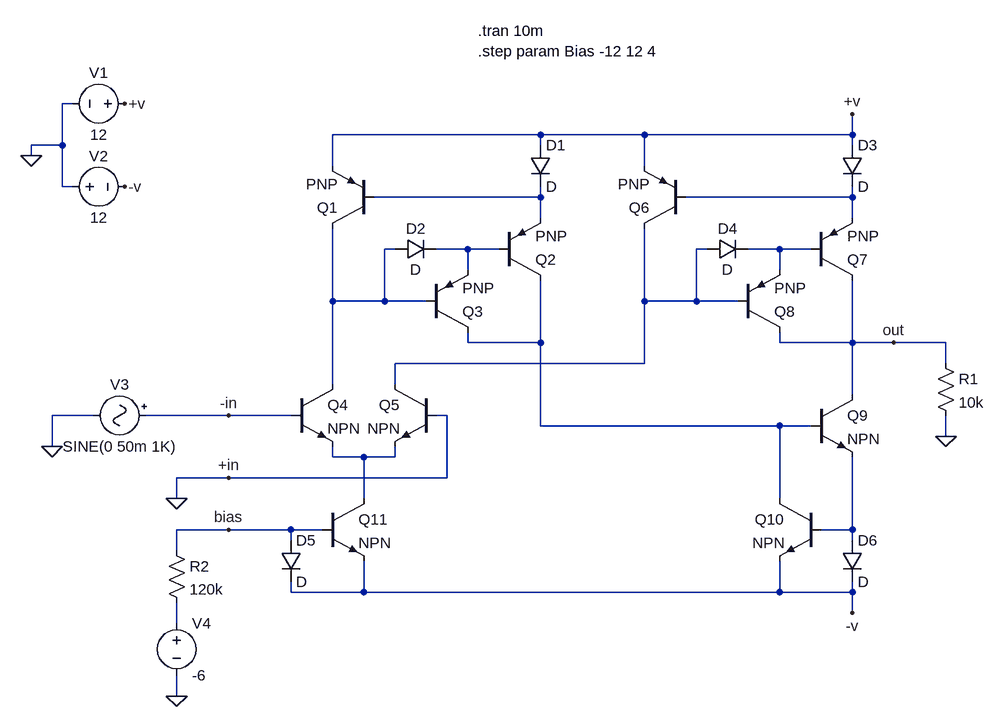
[diagram p0: schematic op-amp.asc]
op-amp.asc, the LTspice schematic file:
Version 4
SHEET 1 1428 976
WIRE -208 48 -224 48
WIRE 512 96 192 96
WIRE 672 96 512 96
WIRE 992 96 992 64
WIRE 992 96 672 96
WIRE -224 112 -224 48
WIRE -224 112 -272 112
WIRE 512 112 512 96
WIRE 992 112 992 96
WIRE -272 128 -272 112
WIRE 192 144 192 96
WIRE 672 144 672 96
WIRE -224 176 -224 112
WIRE -208 176 -224 176
WIRE 512 192 512 176
WIRE 512 192 256 192
WIRE 992 192 992 176
WIRE 992 192 736 192
WIRE 512 224 512 192
WIRE 992 224 992 192
WIRE 288 272 272 272
WIRE 400 272 352 272
WIRE 448 272 400 272
WIRE 768 272 752 272
WIRE 880 272 832 272
WIRE 928 272 880 272
WIRE 400 304 400 272
WIRE 880 304 880 272
WIRE 192 352 192 240
WIRE 272 352 272 272
WIRE 272 352 192 352
WIRE 336 352 272 352
WIRE 672 352 672 240
WIRE 752 352 752 272
WIRE 752 352 672 352
WIRE 816 352 752 352
WIRE 400 416 400 400
WIRE 512 416 512 320
WIRE 512 416 400 416
WIRE 880 416 880 400
WIRE 992 416 992 320
WIRE 992 416 880 416
WIRE 1056 416 992 416
WIRE 1136 416 1056 416
WIRE 672 448 672 352
WIRE 672 448 288 448
WIRE 1136 448 1136 416
WIRE 192 480 192 352
WIRE 288 480 288 448
WIRE 992 496 992 416
WIRE -176 528 -240 528
WIRE 32 528 -96 528
WIRE 128 528 32 528
WIRE 368 528 352 528
WIRE 512 544 512 416
WIRE 880 544 512 544
WIRE 928 544 880 544
WIRE 1136 560 1136 528
WIRE -240 576 -240 528
WIRE 192 592 192 576
WIRE 240 592 192 592
WIRE 288 592 288 576
WIRE 288 592 240 592
WIRE 32 624 -48 624
WIRE 368 624 368 528
WIRE 368 624 32 624
WIRE -48 656 -48 624
WIRE 240 656 240 592
WIRE 880 656 880 544
WIRE 32 704 -48 704
WIRE 128 704 32 704
WIRE 176 704 128 704
WIRE 992 704 992 592
WIRE 992 704 944 704
WIRE 128 720 128 704
WIRE 992 720 992 704
WIRE -48 736 -48 704
WIRE 128 800 128 784
WIRE 240 800 240 752
WIRE 240 800 128 800
WIRE 880 800 880 752
WIRE 880 800 240 800
WIRE 992 800 992 784
WIRE 992 800 880 800
WIRE 992 832 992 800
WIRE -48 848 -48 816
WIRE -48 960 -48 928
FLAG 1056 416 out
FLAG 32 528 -in
FLAG 32 624 +in
FLAG 32 704 bias
FLAG 992 64 +v
FLAG 992 832 -v
FLAG -272 128 0
FLAG -128 48 +v
FLAG -128 176 -v
FLAG -48 656 0
FLAG 1136 560 0
FLAG -240 576 0
FLAG -48 960 0
SYMBOL pnp 256 240 R180
SYMATTR InstName Q1
SYMBOL pnp 448 320 M180
SYMATTR InstName Q2
SYMBOL pnp 336 400 M180
SYMATTR InstName Q3
SYMBOL diode 496 112 R0
SYMATTR InstName D1
SYMBOL diode 288 256 M90
WINDOW 0 0 32 VBottom 2
WINDOW 3 32 32 VTop 2
SYMATTR InstName D2
SYMBOL npn 128 480 R0
SYMATTR InstName Q4
SYMBOL npn 352 480 M0
SYMATTR InstName Q5
SYMBOL pnp 736 240 R180
SYMATTR InstName Q6
SYMBOL pnp 928 320 M180
SYMATTR InstName Q7
SYMBOL pnp 816 400 M180
SYMATTR InstName Q8
SYMBOL diode 976 112 R0
SYMATTR InstName D3
SYMBOL diode 768 256 M90
WINDOW 0 0 32 VBottom 2
WINDOW 3 32 32 VTop 2
SYMATTR InstName D4
SYMBOL npn 928 496 R0
SYMATTR InstName Q9
SYMBOL npn 944 656 M0
SYMATTR InstName Q10
SYMBOL npn 176 656 R0
SYMATTR InstName Q11
SYMBOL diode 112 720 R0
SYMATTR InstName D5
SYMBOL diode 976 720 R0
SYMATTR InstName D6
SYMBOL voltage -112 48 R90
WINDOW 0 -32 56 VBottom 2
WINDOW 3 32 56 VTop 2
SYMATTR InstName V1
SYMATTR Value 12
SYMBOL voltage -224 176 R270
WINDOW 0 32 56 VTop 2
WINDOW 3 -32 56 VBottom 2
SYMATTR InstName V2
SYMATTR Value 12
SYMBOL res 1120 432 R0
SYMATTR InstName R1
SYMATTR Value 10k
SYMBOL Misc/signal -80 528 R90
WINDOW 0 -32 56 VBottom 2
WINDOW 3 32 56 VTop 2
SYMATTR InstName V3
SYMATTR Value SINE(0 50m 1K)
SYMBOL res -64 720 R0
SYMATTR InstName R2
SYMATTR Value 120k
SYMBOL voltage -48 832 R0
SYMATTR InstName V4
SYMATTR Value -6
TEXT 416 -64 Left 2 !.tran 10m\n.step param Bias -12 12 4

The netlist it stands for:
* op-amp.asc
Q1 N003 N001 +v 0 PNP
Q2 N007 N004 N001 0 PNP
Q3 N007 N003 N004 0 PNP
D1 +v N001 D
D2 N003 N004 D
Q4 N003 -in N008 0 NPN
Q5 N005 0 N008 0 NPN
Q6 N005 N002 +v 0 PNP
Q7 out N006 N002 0 PNP
Q8 out N005 N006 0 PNP
D3 +v N002 D
D4 N005 N006 D
Q9 out N007 N009 0 NPN
Q10 N007 N009 -v 0 NPN
Q11 N008 bias -v 0 NPN
D5 bias -v D
D6 N009 -v D
V1 +v 0 12
V2 0 -v 12
R1 out 0 10k
V3 -in 0 SINE(0 50m 1K)
R2 bias N010 120k
V4 N010 0 -6
.model D D
.lib standard.dio
.model NPN NPN
.model PNP PNP
.lib standard.bjt
.tran 10m
.step param Bias -12 12 4
.backanno
.end